# EasyEDA schematic 1 Schematic_HF Upconverter (SMD).json

## Sheets
1 HF Upconverter (SMD): Power circuit: TITLE: HF Upconverter (SMD): Power circuit; REV: 10.17.EE; Date: 2018-05-01; Sheet: 1/3; Drawn By: IgrikXD
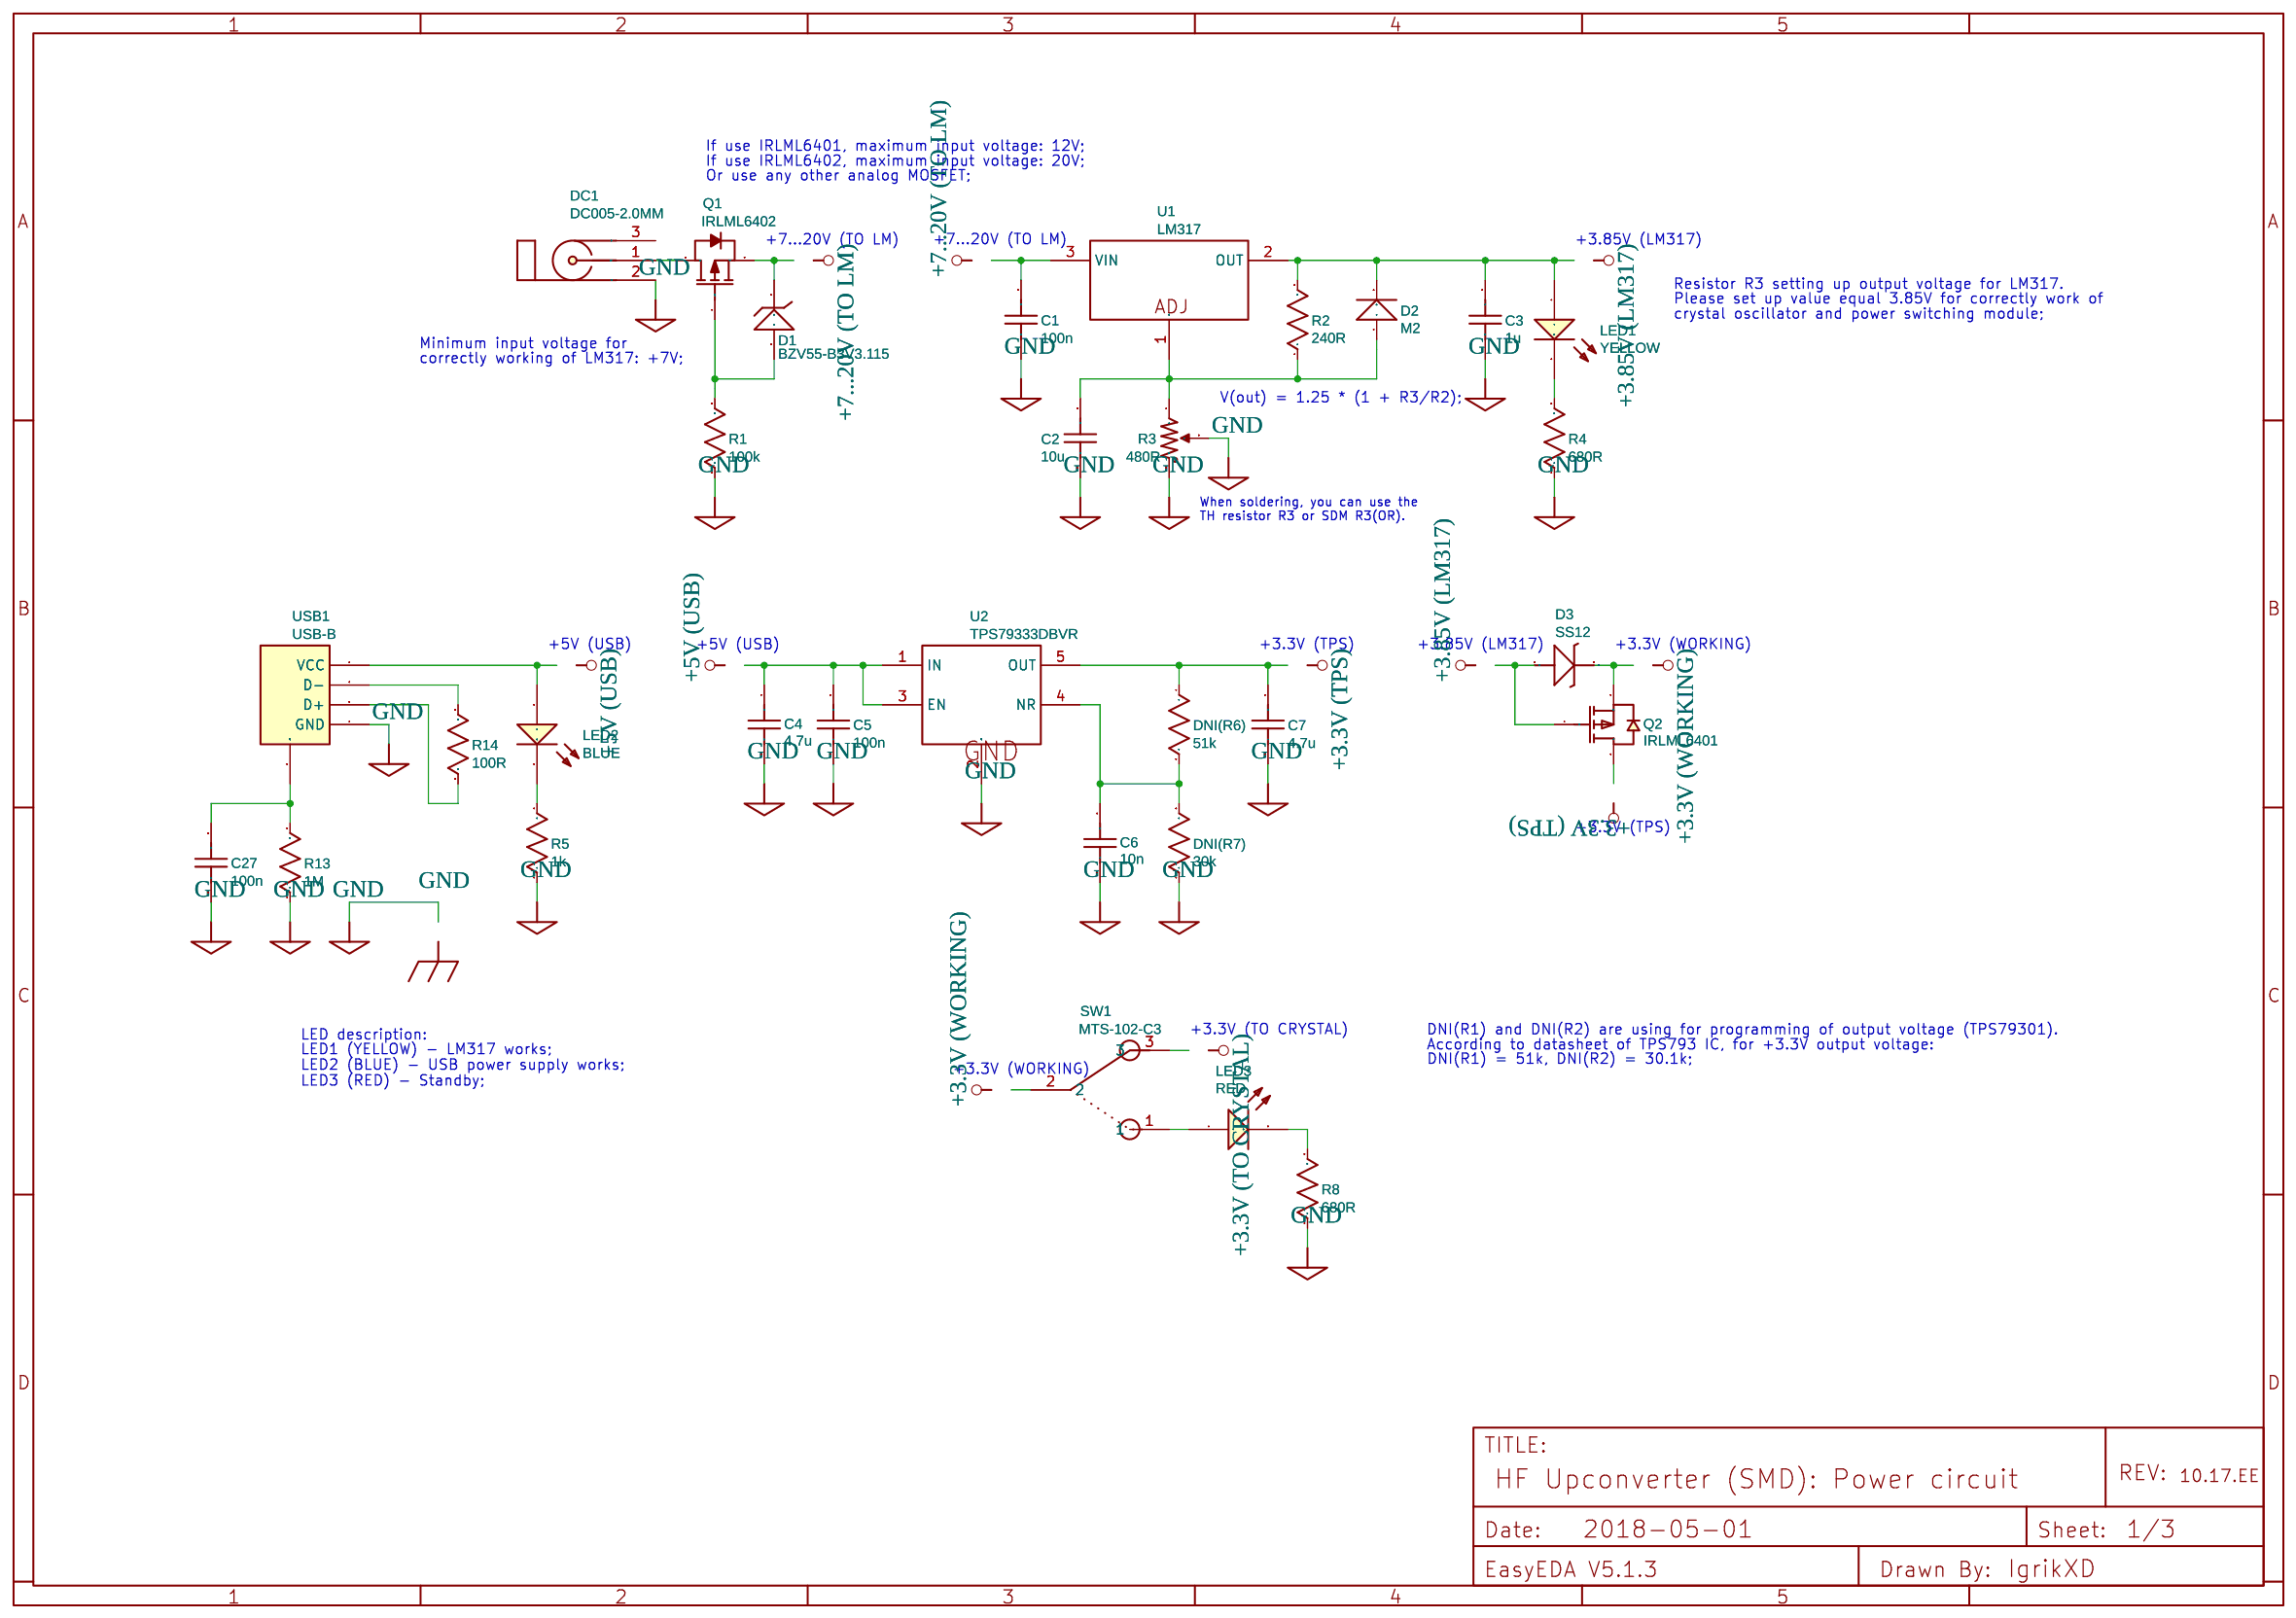
[diagram p0: HF Upconverter (SMD): Power circuit]
2 HF Upconverter (SMD): Crystal oscillator: TITLE: HF Upconverter (SMD): Crystal oscillator; Sheet: 2/3
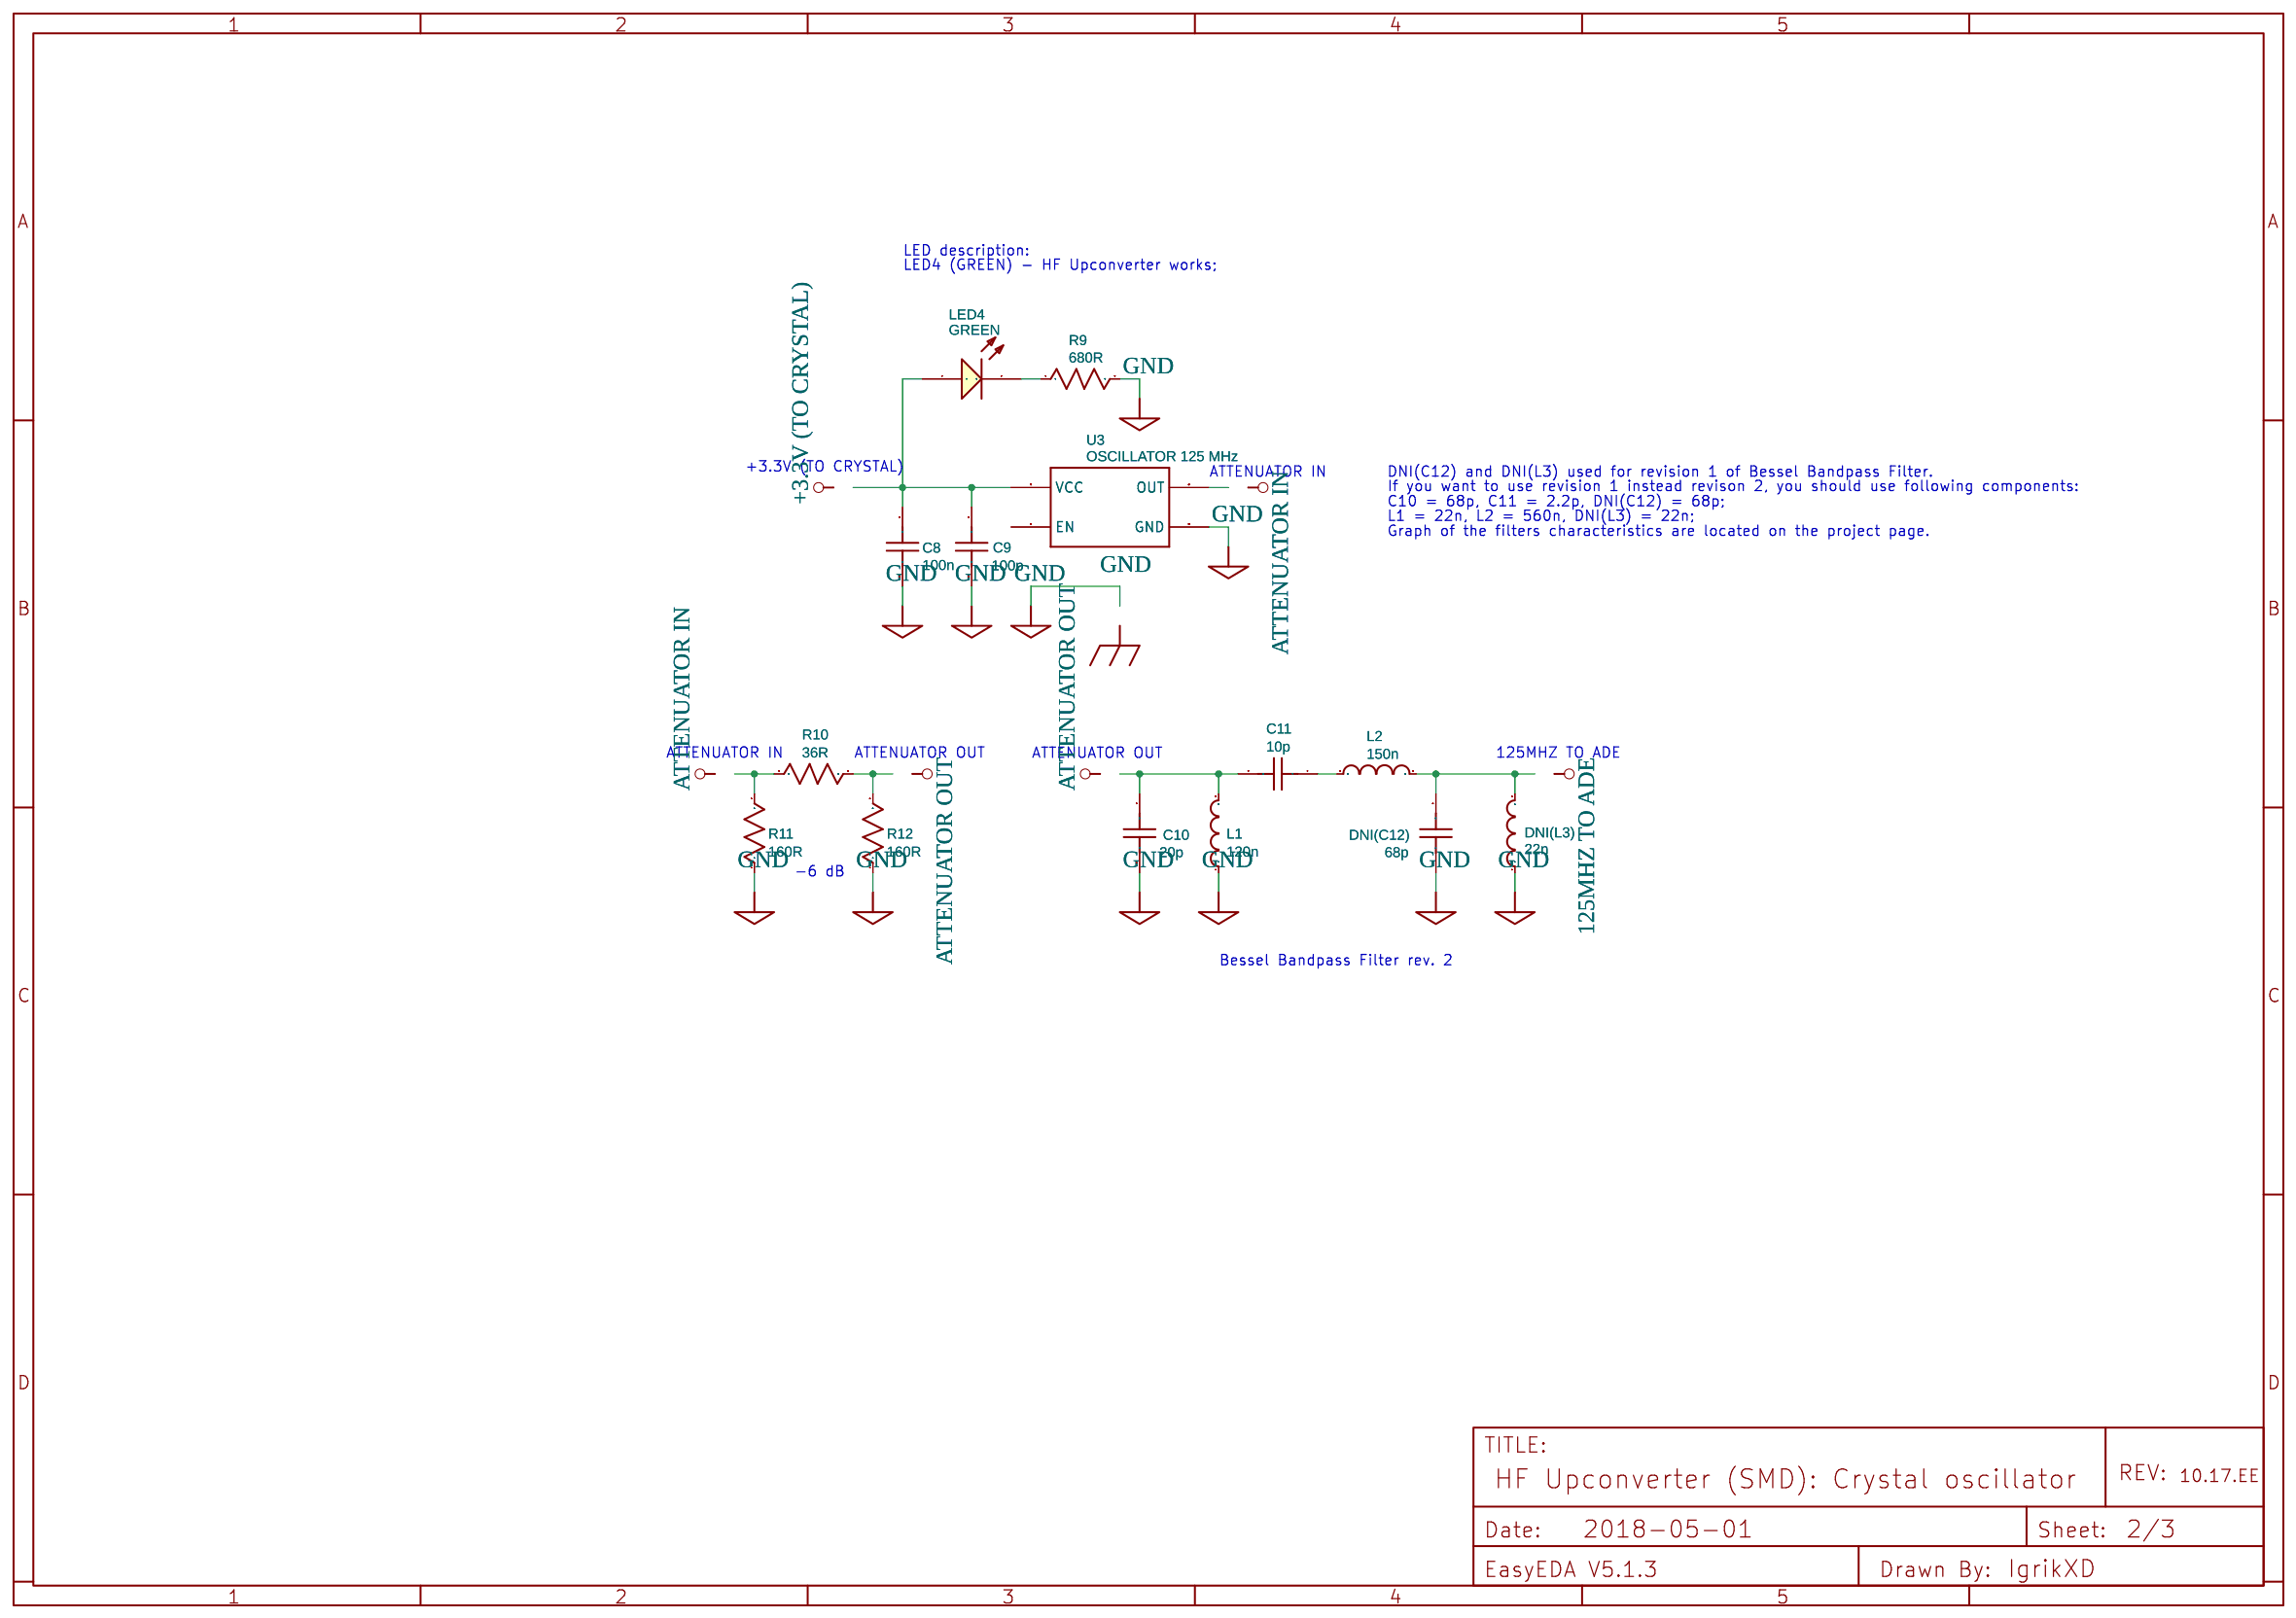
[diagram p1: HF Upconverter (SMD): Crystal oscillator]
3 HF Upconverter (SMD): Mixer with filters: TITLE: HF Upconverter (SMD): Mixer with filters; Sheet: 3/3
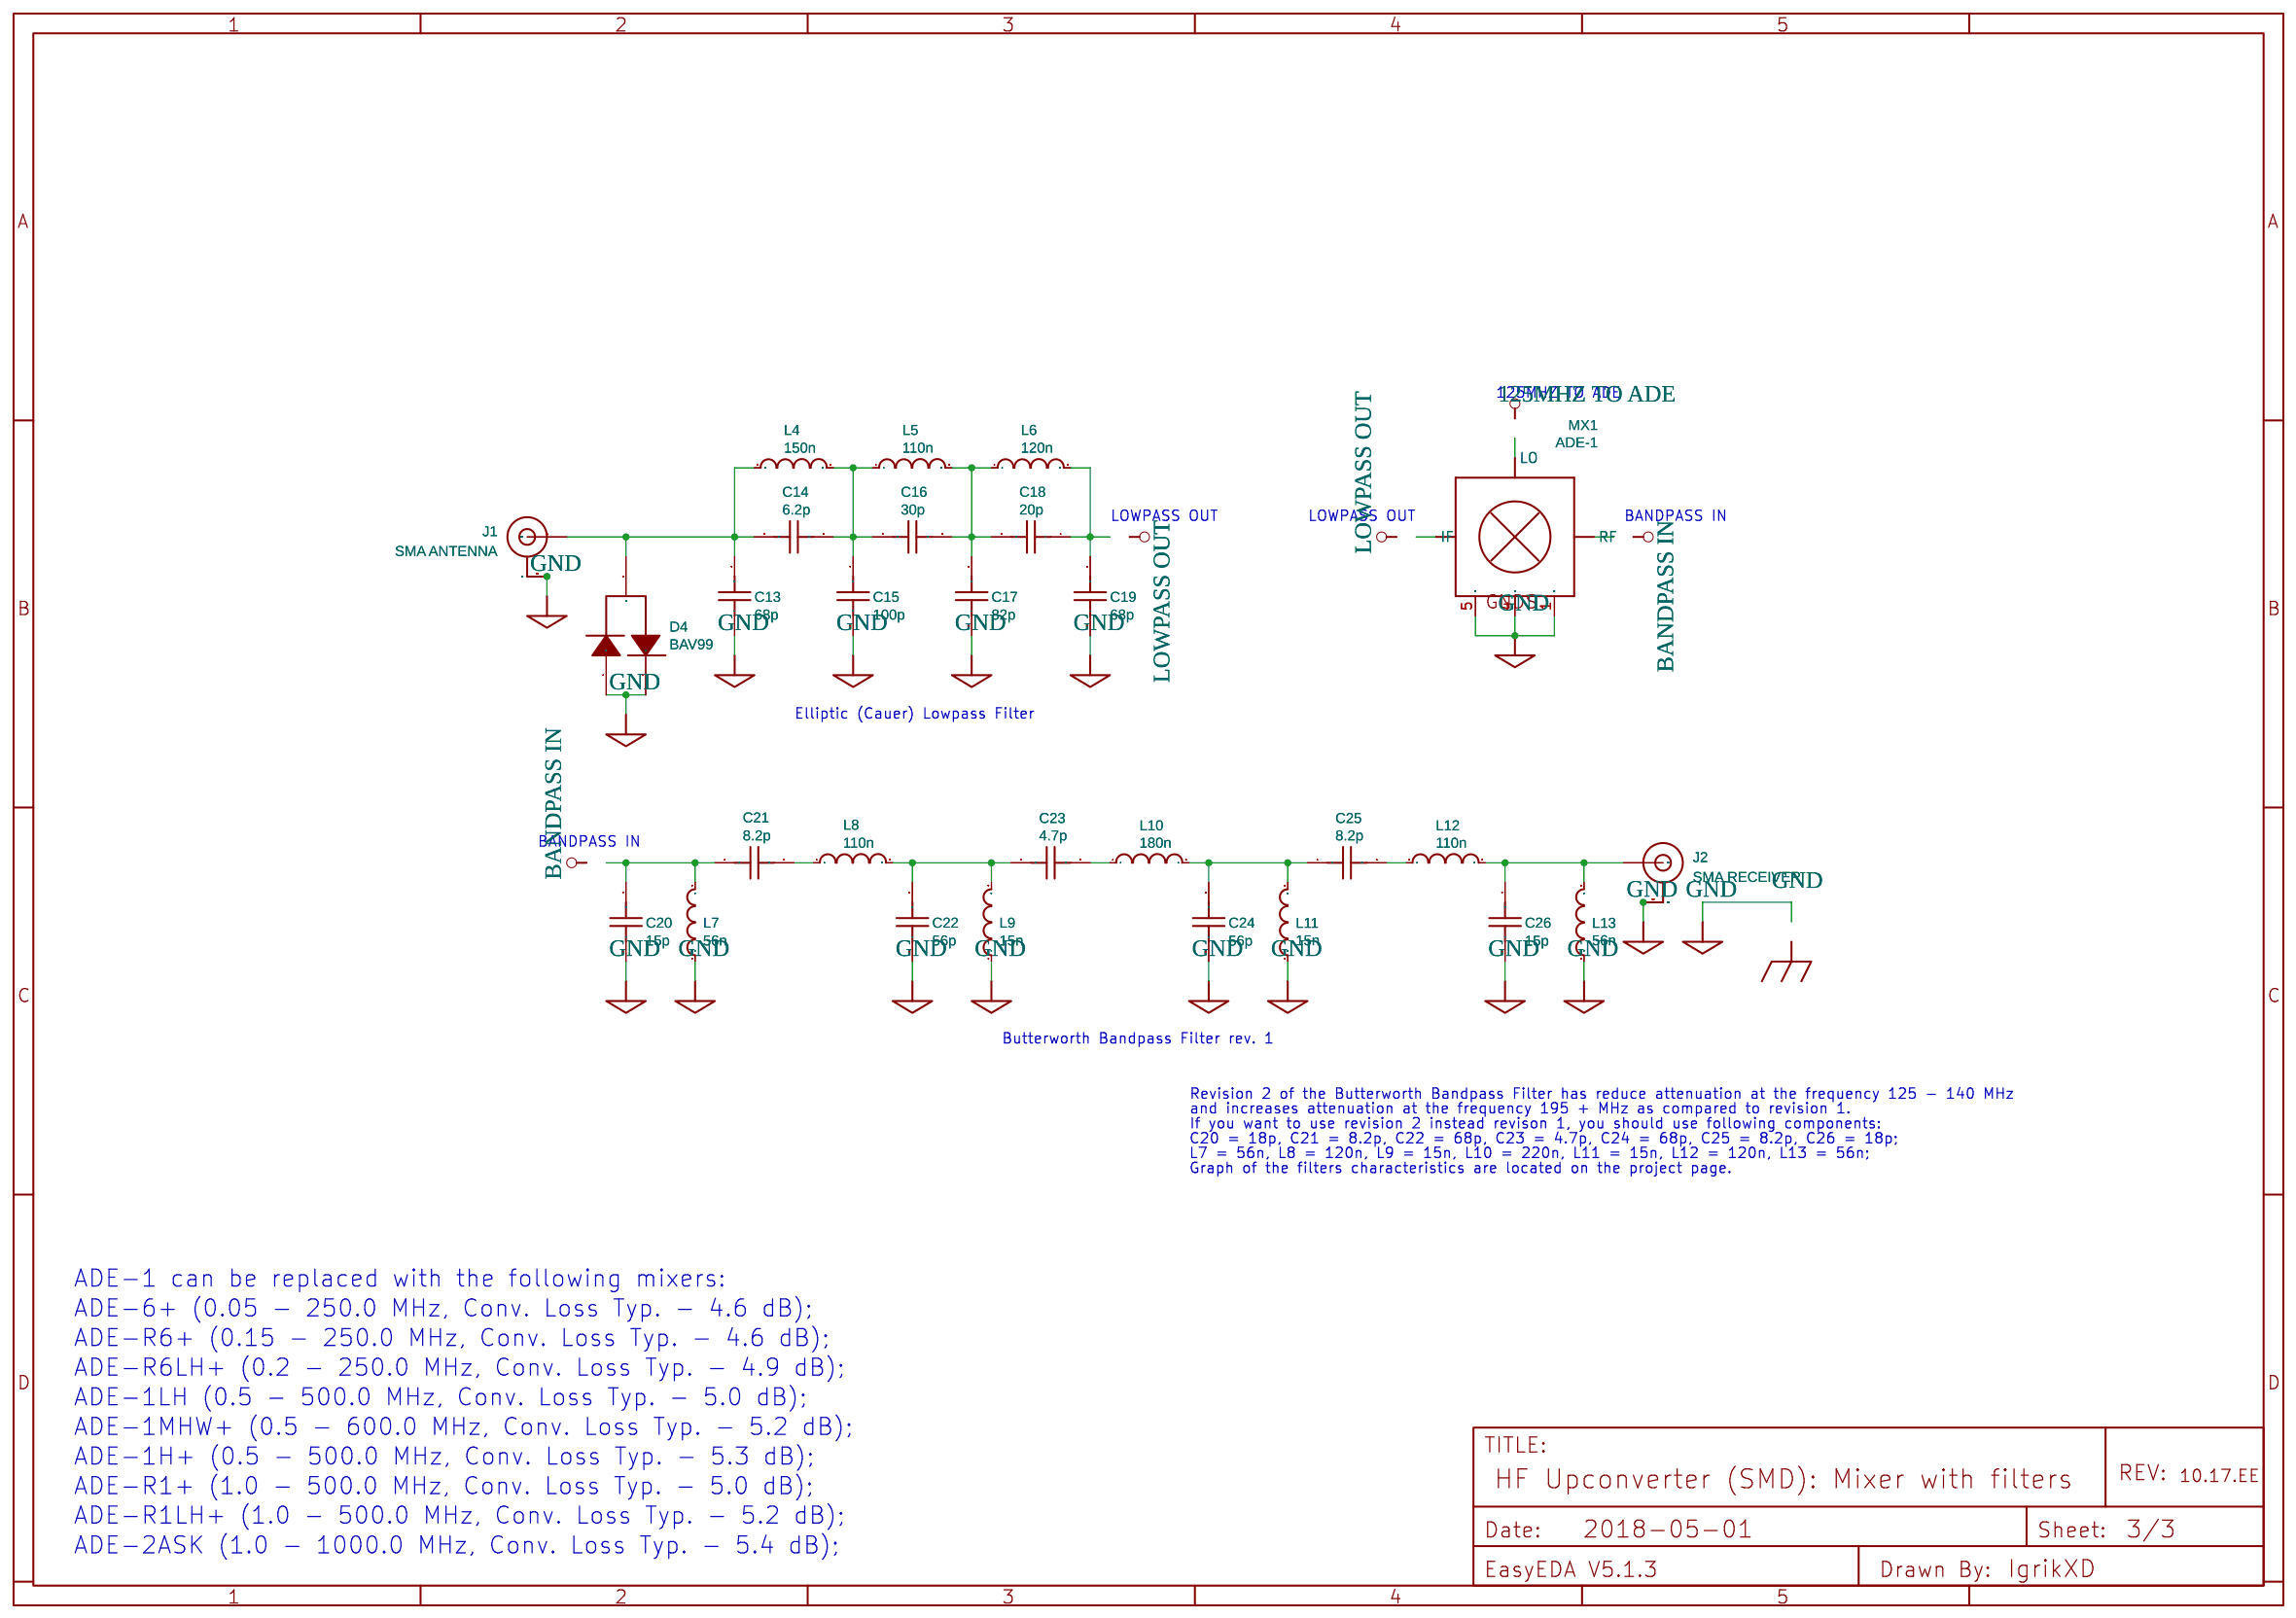
[diagram p2: HF Upconverter (SMD): Mixer with filters]

## Parts
sheet HF Upconverter (SMD): Crystal oscillator
C8  100n  [0805]
C9  100p  [0805]
C10  20p  [0805]
C11  10p  [0805]
DNI(C12)  68p  [0805]
DNI(L3)  22n  [0805]
L1  120n  [0805]
L2  150n  [0805]
LED4  GREEN  [LED-0805]
R9  680R  [0805]
R10  36R  [0805]
R11  160R  [0805]
R12  160R  [0805]
U3  OSCILLATOR 125 MHz  [CRYSTAL-SMD-7X5]
sheet HF Upconverter (SMD): Mixer with filters
C13  68p  [0805]
C14  6.2p  [0805]
C15  100p  [0805]
C16  30p  [0805]
C17  82p  [0805]
C18  20p  [0805]
C19  68p  [0805]
C20  15p  [0805]
C21  8.2p  [0805]
C22  56p  [0805]
C23  4.7p  [0805]
C24  56p  [0805]
C25  8.2p  [0805]
C26  15p  [0805]
D4  BAV99  [SOT-23(SOT-23-3)]
J1  SMA ANTENNA  [SMA-EDGE]
J2  SMA RECEIVER  [SMA-EDGE]
L4  150n  [0805]
L5  110n  [0805]
L6  120n  [0805]
L7  56n  [0805]
L8  110n  [0805]
L9  15n  [0805]
L10  180n  [0805]
L11  15n  [0805]
L12  110n  [0805]
L13  56n  [0805]
MX1  ADE-1  [CD636]
sheet HF Upconverter (SMD): Power circuit
C1  100n  [0805]
C2  10u  [0805]
C3  1u  [0805]
C4  4.7u  [0805]
C5  100n  [0805]
C6  10n  [0805]
C7  4.7u  [0805]
C27  100n  [0805]
D1  BZV55-B3V3.115  [DO-213AC]
D2  M2  [DO214AC]
D3  SS12  [DO214AC]
DC1  DC005-2.0MM  [DC-5020]
DNI(R6)  51k  [0805]
DNI(R7)  30k  [0805]
LED1  YELLOW  [LED-0805]
LED2  BLUE  [LED-0805]
LED3  RED  [LED-0805]
Q1  IRLML6402  [SOT-23(SOT-23-3)]
Q2  IRLML6401  [SOT-23(SOT-23-3)]
R1  100k  [0805]
R2  240R  [0805]
R3  480R  [RES-ADJ_3296W]
R4  680R  [0805]
R5  1k  [0805]
R8  680R  [0805]
R13  1M  [0805]
R14  100R  [0805]
SW1  MTS-102-C3  [MTS-102-C3]
U1  LM317  [TO-252-2]
U2  TPS79333DBVR  [SOT23-5]
USB1  USB-B  [USB TYPE B]

## Library data of the parts
C1 C5 C8 C27 = Capacitor: Manufacturer Part: 08055C104JAT2A; Supplier: LCSC; LCSC: C129175; Manufacturer: AVX
C9 C15 = Capacitor: Manufacturer Part: C2012C0G2A101JT000N; Supplier: LCSC; LCSC: C76633; Manufacturer: TDK
C10 C18 = Capacitor: Manufacturer Part: 0805CG200J500NT; Supplier: LCSC; LCSC: C94472; Manufacturer: FH
C11 = Capacitor: Manufacturer Part: 0805N100J500; Supplier: LCSC; LCSC: C123640; Manufacturer: WTC
C13 C19 DNI(C12) = Capacitor: Supplier: LCSC; LCSC: C123650; Manufacturer: WTC; Manufacturer Part: 0805N680J500
DNI(L3) = Inductor: Manufacturer Part: BKW0805UC022JGT; Supplier: LCSC; LCSC: C107467; Manufacturer: FH-BK
L1 L6 = Inductor: Manufacturer Part: BKW0805UCR12JGT; Supplier: LCSC; LCSC: C98546; Manufacturer: FH-BK
L2 L4 = Inductor: Manufacturer Part: BKW0805UCR15JGT; Supplier: LCSC; LCSC: C107465; Manufacturer: FH-BK
LED4 = -: Supplier: LCSC; Manufacturer: EVERLIGHT; Manufacturer Part: 17-21/GHC-YR1S2/3T; LCSC: C73546
R8 R9 = Resistor: Manufacturer Part: RC0805FR-07680RL; Supplier: LCSC; Manufacturer: YAGEO; LCSC: C114549
R10 = Resistor: Manufacturer Part: RTT0536R0FTP; Supplier: LCSC; LCSC: C104270; Manufacturer: RALEC
R11 R12 = Resistor: Manufacturer Part: CR0805F81600G; Supplier: LCSC; LCSC: C101494; Manufacturer: LIZ
U3 = -: catid: 20; Contributor: SparkFun; Manufacturer Part: FNEPON125; Supplier: Digi-Key; Digi-Key: FNEPON125TR-ND; Manufacturer: Diodes Incorporated
C14 = Capacitor: Manufacturer Part: 0805CG6R2C500NT; Supplier: LCSC; LCSC: C1831; Manufacturer: FH
C16 = Capacitor: Manufacturer Part: CC0805JRNPO9BN300; Supplier: LCSC; LCSC: C107114; Manufacturer: YAGEO
C17 = Capacitor: Manufacturer Part: 0805CG820J500NT; Supplier: LCSC; LCSC: C1841; Manufacturer: FH
C20 = Capacitor: Supplier: LCSC; LCSC: C1794; Manufacturer: SAMSUNG; Manufacturer Part: CL21C150JBANNNC
C21 = Capacitor: Supplier: LCSC; LCSC: C1840; Manufacturer: FH; Manufacturer Part: 0805CG8R2C500NT
C22 C24 = Capacitor: Manufacturer Part: 0805CG560J500NT; Supplier: LCSC; LCSC: C1828; Manufacturer: FH
C23 = Capacitor: Manufacturer Part: 0805CG4R7C500NT; Supplier: LCSC; LCSC: C1820; Manufacturer: FH
C25 = Capacitor: Manufacturer Part: 0805CG8R2C500NT; Supplier: LCSC; LCSC: C1840; Manufacturer: FH
C26 = Capacitor: Manufacturer Part: CL21C150JBANNNC; Supplier: LCSC; LCSC: C1794; Manufacturer: SAMSUNG
D4 = -: Supplier: LCSC; Manufacturer: SEMTECH; LCSC: C83868
J1 = -: SMA Antenna Connector; catid: 20; Contributor: Pinoccio; Manufacturer Part: CON-SMA-EDGE-S; Manufacturer: RF Solutions; Supplier: Digi-Key; Digi-Key: CON-SMA-EDGE-S-ND
J2 = -: SMA Antenna Connector; catid: 20; Contributor: Pinoccio; Manufacturer Part: CON-SMA-EDGE-S; Supplier: Digi-Key; Manufacturer: RF Solutions; Digi-Key: CON-SMA-EDGE-S-ND
L5 L8 L12 = Inductor: Manufacturer Part: LQW18ANR11G00D; Supplier: LCSC; LCSC: C113130; Manufacturer: MuRata
L7 = Inductor: Supplier: LCSC; LCSC: C98534; Manufacturer: FH-BK; Manufacturer Part: BKW0805UC056JGT
L9 = Inductor: Supplier: LCSC; LCSC: C107468; Manufacturer Part: BKW0805UC015JGT; Manufacturer: FH-BK
L10 = Inductor: Manufacturer Part: BKW0805UCR18JGT; Supplier: LCSC; LCSC: C107466; Manufacturer: FH-BK
L11 = Inductor: Manufacturer Part: BKW0805UC015JGT; Supplier: LCSC; LCSC: C107468; Manufacturer: FH-BK
L13 = Inductor: Manufacturer Part: BKW0805UC056JGT; Supplier: LCSC; LCSC: C98534; Manufacturer: FH-BK
MX1 = -: catid: 20; Supplier: Mini Circuits; Mini Circuits: ADE-1+; Manufacturer: Mini Circuits; Manufacturer Part: NOT DEFINED
C2 = Capacitor: Manufacturer Part: GRM21BR71A106KE51L; Supplier: LCSC; LCSC: C86038; Manufacturer: MuRata
C3 = Capacitor: Manufacturer Part: CL21B105KAFNFNE; Supplier: LCSC; LCSC: C1712; Manufacturer: SAMSUNG
C4 C7 = Capacitor: Manufacturer Part: 0805X475K250NT; Supplier: LCSC; LCSC: C67142; Manufacturer: FH
C6 = Capacitor: Manufacturer Part: 0805CG103J500NT; Supplier: LCSC; LCSC: C63849; Manufacturer: FH
D1 = -: catid: 20; Manufacturer Part: BZV55-C3V3,115; Supplier: LCSC; LCSC: C128828; Manufacturer: Nexperia
D2 = -: catid: 20; Manufacturer Part: M2 GPP; Supplier: LCSC; LCSC: C123826; Manufacturer: MDD
D3 = -: catid: 20; Contributor: SparkFun; Manufacturer Part: SS12-LTP; Supplier: LCSC; LCSC: C85684; Manufacturer: MCC
DC1 = -: Supplier: LCSC; Manufacturer: BOOMELE; Manufacturer Part: DC-005 5.5-2.0MM; LCSC: C16214
DNI(R6) = Resistor: Manufacturer Part: RTT055102FTP; Supplier: LCSC; LCSC: C104376; Manufacturer: RALEC
DNI(R7) = Resistor: Manufacturer Part: RTT053002FTP; Supplier: LCSC; LCSC: C104202; Manufacturer: RALEC
LED1 = -: Supplier: LCSC; Manufacturer: EVERLIGHT; Manufacturer Part: 17-215UYC/S530-A3/TR8; LCSC: C72036
LED2 = -: Supplier: LCSC; Manufacturer: EVERLIGHT; Manufacturer Part: 17-21/BHC-AP1Q2/3T; LCSC: C99870
LED3 = -: Supplier: LCSC; Manufacturer: EVERLIGHT; Manufacturer Part: 17-215/R6C-AQ1R2B/3T; LCSC: C86865
Q1 = -: Supplier: LCSC; Manufacturer: IR; Manufacturer Part: IRLML6402TRPBF; LCSC: C2593
Q2 = -: Supplier: LCSC; Manufacturer: IR; Manufacturer Part: IRLML6401TRPBF; LCSC: C3034
R1 = Resistor: Manufacturer Part: RC0805FR-07100KL; Supplier: LCSC; LCSC: C96346; Manufacturer: YAGEO
R2 = Resistor: Manufacturer Part: CR0805F82400G; Supplier: LCSC; Manufacturer: LIZ; LCSC: C101586
R3 = Potentiometer: K(%): 50; Manufacturer Part: 3296W-1-102LF; Supplier: LCSC; LCSC: C57089; Manufacturer: BOURNS
R4 = Resistor: Manufacturer Part: RC0805FR-07680RL; Manufacturer: YAGEO; Supplier: LCSC; LCSC: C114549
R5 = Resistor: Manufacturer Part: RTT051001FTP; Supplier: LCSC; LCSC: C103903; Manufacturer: RALEC
R13 = Resistor: Manufacturer Part: RC0805FR-071ML; Supplier: LCSC; LCSC: C107700; Manufacturer: YAGEO
R14 = Resistor: Supplier: LCSC; LCSC: C119304; Manufacturer: Chian Chia Elec
SW1 = -: Contributor: snhunter; sourceId: LjTecMmIi
U1 = -: Supplier: LCSC; Manufacturer: UTC; Manufacturer Part: LM317AG-TN3-R; LCSC: C75510
U2 = -: Single Output High PSRR LDO, 200 mA, Fixed 3.3 V Output, 2.7 to 5.5 V Input, 5-pin SOT-23 (DBV), -40 to 85 degC, Green (RoHS  no SbBr); catid: 20; Supplier: LCSC; LCSC: C9840; Manufacturer: TI
USB1 = -: Supplier: LCSC; Manufacturer: LCSC; Manufacturer Part: USB BFemale90 White plastic; LCSC: C46393

## Nets
+3.3V (TO CRYSTAL): C8.2 C9.2 LED4.1(A) SW1.3 U3.P$4(VCC)
+3.3V (TPS): C7.2 DNI(R6).1 Q2.3(D) U2.5(OUT)
+3.3V (WORKING): D3.2(C) Q2.2(S) SW1.2
+3.85V (LM317): C3.2 D2.2(C) D3.1(A) LED1.1(A) Q2.1(G) R2.2 U1.2(OUT)
+5V (USB): C4.1 C5.2 LED2.1(A) U2.1(IN) U2.3(EN) USB1.1(VCC)
GND: C1.1 C2.1 C3.1 C4.2 C5.1 C6.1 C7.1 C8.1 C9.1 C10.1 C13.1 C15.2 C17.1 C19.1 C20.1 C22.1 C24.1 C26.1 C27.1 D4.1 D4.2 DC1.2 DNI(C12).1 DNI(L3).1 DNI(R7).1 J1.GND@0(GND) J1.GND@1(GND) J1.GND@2(GND) J1.GND@3(GND) J2.GND@0(GND) J2.GND@1(GND) J2.GND@2(GND) J2.GND@3(GND) L1.1 L7.1 L9.1 L11.1 L13.1 MX1.1(GND) MX1.4(GND) MX1.5(GND) R1.1 R3.2(3) R3.3(2) R4.1 R5.1 R8.1 R9.2 R11.1 R12.1 R13.1 U2.2(GND) U3.P$2(GND) USB1.4(GND)
125MHZ TO ADE: DNI(C12).2 DNI(L3).2 L2.2 MX1.6(LO)
+7...20V (TO LM): C1.2 D1.2(C) Q1.2(S) U1.3(VIN)
ATTENUATOR IN: R10.1 R11.2 U3.P$3(OUT)
ATTENUATOR OUT: C10.2 C11.2 L1.2 R10.2 R12.2
BANDPASS IN: C20.2 C21.1 L7.2 MX1.3(RF)
LOWPASS OUT: C18.1 C19.2 L6.2 MX1.2(IF)
C11_1: C11.1 L2.1
C14_1: C14.1 C15.1 C16.1 L4.2 L5.1
C16_2: C16.2 C17.2 C18.2 L5.2 L6.1
C21_2: C21.2 L8.1
C23_2: C23.2 L10.1
C25_2: C25.2 L12.1
D+: R14.1 USB1.3(D+)
L8_2: C22.2 C23.1 L8.2 L9.2
L10_2: C24.2 C25.1 L10.2 L11.2
Net-(C2-2): C2.2 D2.1(A) R2.1 R3.1 U1.1(ADJ)
Net-(C13-2): C13.2 C14.2 D4.3 J1.SIG(SIGNAL) L4.1
Net-(C26-2): C26.2 J2.SIG(SIGNAL) L12.2 L13.2
Net-(LED1-2): LED1.2(C) R4.2
Net-(LED2-2): LED2.2(C) R5.2
Net-(LED3-1): LED3.1(A) SW1.1
Net-(LED3-2): LED3.2(C) R8.2
Net-(LED4-2): LED4.2(C) R9.1
Net-(R14-2): R14.2 USB1.2(D-)
PE: C27.2 R13.2 USB1.5(CASE)
Q1_1: D1.1(A) Q1.1(G) R1.2
Q1_3: DC1.1(VCC) Q1.3(D)
U2_4: C6.2 DNI(R6).2 DNI(R7).2 U2.4(NR)

Not connected (* = marked no-connect by the designer): DC1 3; U3 P$1(EN)

## Notes on the sheets
sheet 1
- If use IRLML6401, maximum input voltage: 12V;
- If use IRLML6402, maximum input voltage: 20V;
- Or use any other analog MOSFET;
- +7...20V (TO LM)
- +7...20V (TO LM)
- +3.85V (LM317)
- Resistor R3 setting up output voltage for LM317.
- Please set up value equal 3.85V for correctly work of
- crystal oscillator and power switching module;
- Minimum input voltage for
- correctly working of LM317: +7V;
- V(out) = 1.25 * (1 + R3/R2);
- When soldering, you can use the
  TH resistor R3 or SDM R3(OR).
- +5V (USB)
- +5V (USB)
- +3.3V (TPS)
- +3.85V (LM317)
- +3.3V (WORKING)
- +3.3V (TPS)
- +3.3V (TO CRYSTAL)
- DNI(R1) and DNI(R2) are using for programming of output voltage (TPS79301).
- LED description:
- LED1 (YELLOW) - LM317 works;
- According to datasheet of TPS793 IC, for +3.3V output voltage:
- LED2 (BLUE) - USB power supply works;
- +3.3V (WORKING)
- DNI(R1) = 51k, DNI(R2) = 30.1k;
- LED3 (RED) - Standby;
sheet 2
- LED description:
- LED4 (GREEN) - HF Upconverter works;
- +3.3V (TO CRYSTAL)
- ATTENUATOR IN
- DNI(C12) and DNI(L3) used for revision 1 of Bessel Bandpass Filter.
- If you want to use revision 1 instead revison 2, you should use following components:
- C10 = 68p, C11 = 2.2p, DNI(C12) = 68p;
- L1 = 22n, L2 = 560n, DNI(L3) = 22n;
- Graph of the filters characteristics are located on the project page.
- ATTENUATOR IN
- ATTENUATOR OUT
- ATTENUATOR OUT
- 125MHZ TO ADE
- -6 dB
- Bessel Bandpass Filter rev. 2
sheet 3
- 125MHZ TO ADE
- LOWPASS OUT
- LOWPASS OUT
- BANDPASS IN
- Elliptic (Cauer) Lowpass Filter
- BANDPASS IN
- Butterworth Bandpass Filter rev. 1
- Revision 2 of the Butterworth Bandpass Filter has reduce attenuation at the frequency 125 - 140 MHz
- If you want to use revision 2 instead revison 1, you should use following components:
- and increases attenuation at the frequency 195 + MHz as compared to revision 1.
- C20 = 18p, C21 = 8.2p, C22 = 68p, C23 = 4.7p, C24 = 68p, C25 = 8.2p, C26 = 18p;
- Graph of the filters characteristics are located on the project page.
- L7 = 56n, L8 = 120n, L9 = 15n, L10 = 220n, L11 = 15n, L12 = 120n, L13 = 56n;
- ADE-1 can be replaced with the following mixers:
- ADE-6+ (0.05 - 250.0 MHz, Conv. Loss Typ. - 4.6 dB);
- ADE-R6+ (0.15 - 250.0 MHz, Conv. Loss Typ. - 4.6 dB);
- ADE-R6LH+ (0.2 - 250.0 MHz, Conv. Loss Typ. - 4.9 dB);
- ADE-1LH (0.5 - 500.0 MHz, Conv. Loss Typ. - 5.0 dB);
- ADE-1MHW+ (0.5 - 600.0 MHz, Conv. Loss Typ. - 5.2 dB);
- ADE-1H+ (0.5 - 500.0 MHz, Conv. Loss Typ. - 5.3 dB);
- ADE-R1+ (1.0 - 500.0 MHz, Conv. Loss Typ. - 5.0 dB);
- ADE-R1LH+ (1.0 - 500.0 MHz, Conv. Loss Typ. - 5.2 dB);
- ADE-2ASK (1.0 - 1000.0 MHz, Conv. Loss Typ. - 5.4 dB);
